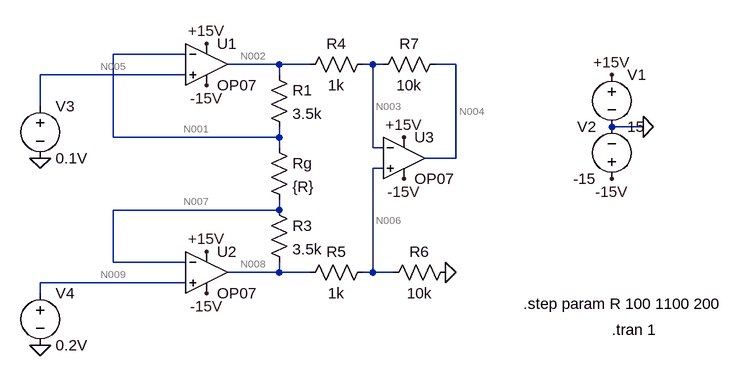
[diagram p0: schematic Instrumentation_Amplifier.asc]
Instrumentation_Amplifier.asc, the LTspice schematic file:
Version 4
SHEET 1 880 680
WIRE 16 16 -96 16
WIRE 160 32 80 32
WIRE 208 32 160 32
WIRE 304 32 288 32
WIRE 320 32 304 32
WIRE 432 32 400 32
WIRE 16 48 -208 48
WIRE 160 48 160 32
WIRE -208 96 -208 48
WIRE 720 128 672 128
WIRE -96 144 -96 16
WIRE 160 144 160 128
WIRE 160 144 -96 144
WIRE 160 160 160 144
WIRE 304 160 304 32
WIRE 320 160 304 160
WIRE 432 176 432 32
WIRE 432 176 384 176
WIRE 320 192 304 192
WIRE 160 256 160 240
WIRE 160 256 -96 256
WIRE -96 336 -96 256
WIRE 16 336 -96 336
WIRE 160 352 160 336
WIRE 160 352 80 352
WIRE 208 352 160 352
WIRE 304 352 304 192
WIRE 304 352 288 352
WIRE 336 352 304 352
WIRE 16 368 -208 368
WIRE -208 384 -208 368
FLAG 416 352 0
FLAG 720 128 0
FLAG 672 48 +15V
FLAG 48 0 +15V
FLAG 48 320 +15V
FLAG 352 144 +15V
FLAG 672 208 -15V
FLAG 48 64 -15V
FLAG 48 384 -15V
FLAG 352 208 -15V
FLAG -208 176 0
FLAG -208 464 0
SYMBOL OpAmps\\OP07 48 -32 R0
SYMATTR InstName U1
SYMBOL OpAmps\\OP07 48 288 R0
SYMATTR InstName U2
SYMBOL OpAmps\\OP07 352 112 R0
SYMATTR InstName U3
SYMBOL res 144 32 R0
SYMATTR InstName R1
SYMATTR Value 3.5k
SYMBOL res 144 144 R0
SYMATTR InstName Rg
SYMATTR Value {R}
SYMBOL res 144 240 R0
SYMATTR InstName R3
SYMATTR Value 3.5k
SYMBOL res 304 16 R90
WINDOW 0 0 56 VBottom 2
WINDOW 3 32 56 VTop 2
SYMATTR InstName R4
SYMATTR Value 1k
SYMBOL res 304 336 R90
WINDOW 0 0 56 VBottom 2
WINDOW 3 32 56 VTop 2
SYMATTR InstName R5
SYMATTR Value 1k
SYMBOL res 432 336 R90
WINDOW 0 0 56 VBottom 2
WINDOW 3 32 56 VTop 2
SYMATTR InstName R6
SYMATTR Value 10k
SYMBOL res 416 16 R90
WINDOW 0 0 56 VBottom 2
WINDOW 3 32 56 VTop 2
SYMATTR InstName R7
SYMATTR Value 10k
SYMBOL voltage 672 32 R0
WINDOW 123 0 0 Left 0
WINDOW 39 0 0 Left 0
SYMATTR InstName V1
SYMATTR Value 15
SYMBOL voltage 672 224 R180
WINDOW 0 24 96 Left 2
WINDOW 3 24 16 Left 2
WINDOW 123 0 0 Left 0
WINDOW 39 0 0 Left 0
SYMATTR InstName V2
SYMATTR Value -15
SYMBOL voltage -208 80 R0
SYMATTR InstName V3
SYMATTR Value 0.1V
SYMBOL voltage -208 368 R0
SYMATTR InstName V4
SYMATTR Value 0.2V
TEXT 672 440 Left 2 !.tran 1
TEXT 536 400 Left 2 !.step param R 100 1100 200

The netlist it stands for:
* Instrumentation_Amplifier.asc
XU1 N005 N001 +15V -15V N002 LT1001  ; OP07, pins In+ In- V+ V- OUT
XU2 N009 N007 +15V -15V N008 LT1001  ; OP07, pins In+ In- V+ V- OUT
XU3 N006 N003 +15V -15V N004 LT1001  ; OP07, pins In+ In- V+ V- OUT
R1 N002 N001 3.5k
Rg N001 N007 {R}
R3 N007 N008 3.5k
R4 N003 N002 1k
R5 N006 N008 1k
R6 0 N006 10k
R7 N004 N003 10k
V1 +15V 0 15
V2 -15V 0 -15
V3 N005 0 0.1V
V4 N009 0 0.2V
.tran 1
.step param R 100 1100 200
.lib LTC.lib
.backanno
.end

* Results of the author's LTspice run, read from the files saved beside the schematic
* Operating Point (first step), zero values left out:
*   r = 100 
*   V(n001) = 100 mV
*   V(n005) = 100 mV
*   V(+15v) = 15 V
*   V(-15v) = -15 V
*   V(n002) = -3.4 V
*   V(n007) = 200 mV
*   V(n009) = 200 mV
*   V(n008) = 3.7 V
*   V(n003) = -689.2 mV
*   V(n006) = 2.236 V
*   V(n004) = 14.02 V
*   I(R7) = 1.471 mA
*   I(R6) = -223.6 µA
*   I(R5) = -1.463 mA
*   I(R4) = 2.71 mA
*   I(R3) = -999.9 µA
*   I(Rg) = -999.9 µA
*   I(R1) = -999.9 µA
*   I(V2) = 7.252 mA
*   I(V1) = -7.469 mA
*   Ix(u1:3) = 777.2 µA
*   Ix(u1:4) = -4.488 mA
*   Ix(u1:5) = 3.71 mA
*   Ix(u2:3) = 3.65 mA
*   Ix(u2:4) = -1.187 mA
*   Ix(u2:5) = -2.463 mA
*   Ix(u3:1) = 1.24 mA
*   Ix(u3:2) = -1.24 mA
*   Ix(u3:3) = 3.041 mA
*   Ix(u3:4) = -1.578 mA
*   Ix(u3:5) = -1.471 mA
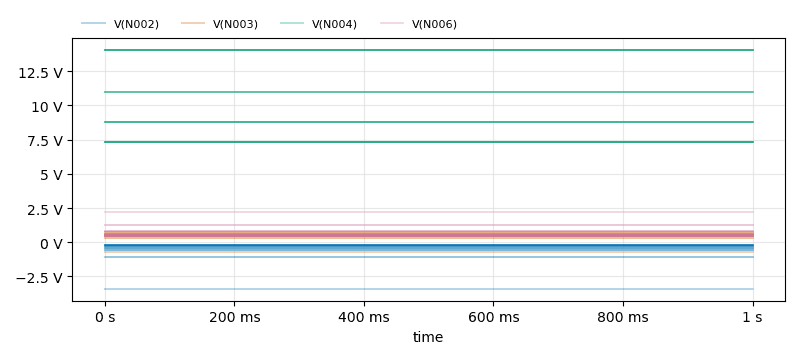
[diagram p1: Transient Analysis of Instrumentation_Amplifier.asc, plotted from the saved traces]
* Transient Analysis, 6 runs:
*   V(N002) [r=100]: min -3.4 V, max -3.4 V, average -3.4 V, rms 3.4 V, last -3.4 V
*   V(N002) [r=300]: min -1.067 V, max -1.067 V, average -1.067 V, rms 1.067 V, last -1.067 V
*   V(N002) [r=500]: min -600 mV, max -600 mV, average -600 mV, rms 600 mV, last -600 mV
*   V(N002) [r=700]: min -400 mV, max -400 mV, average -400 mV, rms 400 mV, last -400 mV
*   V(N002) [r=900]: min -288.9 mV, max -288.9 mV, average -288.9 mV, rms 288.9 mV, last -288.9 mV
*   V(N002) [r=1100]: min -218.2 mV, max -218.2 mV, average -218.2 mV, rms 218.2 mV, last -218.2 mV
*   V(N003) [r=100]: min -689.2 mV, max -689.2 mV, average -689.2 mV, rms 689.2 mV, last -689.2 mV
*   V(N003) [r=300]: min 305.1 mV, max 305.1 mV, average 305.1 mV, rms 305.1 mV, last 305.1 mV
*   V(N003) [r=500]: min 729.4 mV, max 729.4 mV, average 729.4 mV, rms 729.4 mV, last 729.4 mV
*   V(N003) [r=700]: min 636.3 mV, max 636.3 mV, average 636.3 mV, rms 636.3 mV, last 636.3 mV
*   V(N003) [r=900]: min 535.3 mV, max 535.3 mV, average 535.3 mV, rms 535.3 mV, last 535.3 mV
*   V(N003) [r=1100]: min 471.1 mV, max 471.1 mV, average 471.1 mV, rms 471.1 mV, last 471.1 mV
*   V(N004) [r=100]: min 14.02 V, max 14.02 V, average 14.02 V, rms 14.02 V, last 14.02 V
*   V(N004) [r=300]: min 14.02 V, max 14.02 V, average 14.02 V, rms 14.02 V, last 14.02 V
*   V(N004) [r=500]: min 14.02 V, max 14.02 V, average 14.02 V, rms 14.02 V, last 14.02 V
*   V(N004) [r=700]: min 11 V, max 11 V, average 11 V, rms 11 V, last 11 V
*   V(N004) [r=900]: min 8.778 V, max 8.778 V, average 8.778 V, rms 8.778 V, last 8.778 V
*   V(N004) [r=1100]: min 7.363 V, max 7.363 V, average 7.363 V, rms 7.363 V, last 7.363 V
*   V(N006) [r=100]: min 2.236 V, max 2.236 V, average 2.236 V, rms 2.236 V, last 2.236 V
*   V(N006) [r=300]: min 1.242 V, max 1.242 V, average 1.242 V, rms 1.242 V, last 1.242 V
*   V(N006) [r=500]: min 818.2 mV, max 818.2 mV, average 818.2 mV, rms 818.2 mV, last 818.2 mV
*   V(N006) [r=700]: min 636.4 mV, max 636.4 mV, average 636.4 mV, rms 636.4 mV, last 636.4 mV
*   V(N006) [r=900]: min 535.3 mV, max 535.3 mV, average 535.3 mV, rms 535.3 mV, last 535.3 mV
*   V(N006) [r=1100]: min 471.1 mV, max 471.1 mV, average 471.1 mV, rms 471.1 mV, last 471.1 mV